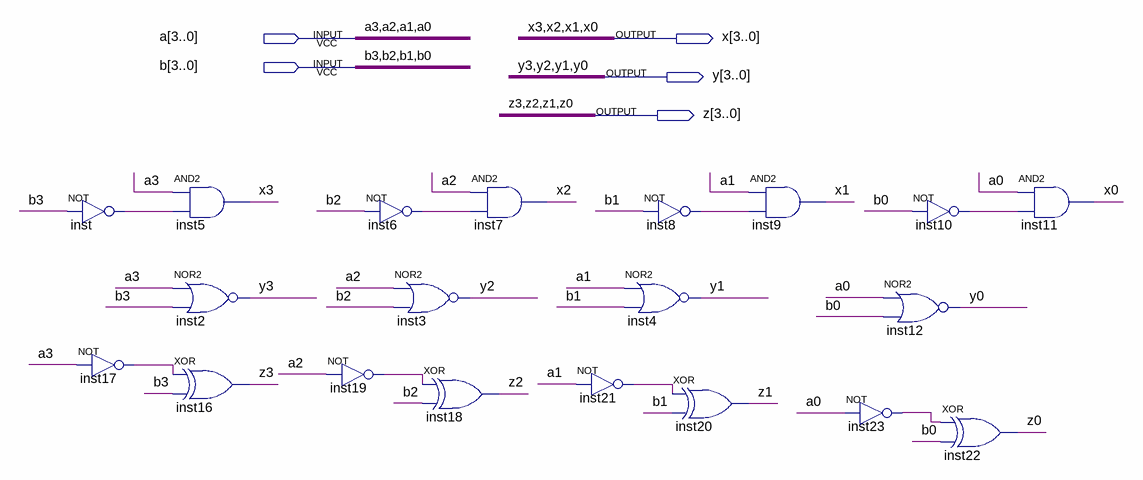
[diagram p0: schematic sheet]
// Quartus schematic lab_4.bdf as structural Verilog: 20 symbols, 5 pins
module lab_4 (
  input  [3:0] a,
  input  [3:0] b,
  output [3:0] x,
  output [3:0] y,
  output [3:0] z
);

  wire inst6_out, inst8_out, inst10_out, inst17_out, inst19_out, inst21_out, inst23_out, inst_out;

  not inst (inst_out, b[3]);
  not inst17 (inst17_out, a[3]);
  and inst5 (x[3], a[3], inst_out);
  nor inst2 (y[3], a[3], b[3]);
  xor inst16 (z[3], inst17_out, b[3]);
  not inst6 (inst6_out, b[2]);
  not inst19 (inst19_out, a[2]);
  nor inst3 (y[2], a[2], b[2]);
  xor inst18 (z[2], inst19_out, b[2]);
  and inst7 (x[2], a[2], inst6_out);
  not inst21 (inst21_out, a[1]);
  not inst8 (inst8_out, b[1]);
  nor inst4 (y[1], a[1], b[1]);
  xor inst20 (z[1], inst21_out, b[1]);
  and inst9 (x[1], a[1], inst8_out);
  not inst10 (inst10_out, b[0]);
  nor inst12 (y[0], a[0], b[0]);
  not inst23 (inst23_out, a[0]);
  xor inst22 (z[0], inst23_out, b[0]);
  and inst11 (x[0], a[0], inst10_out);
endmodule
